# Altium schematic sheet power.SchDoc
size A4
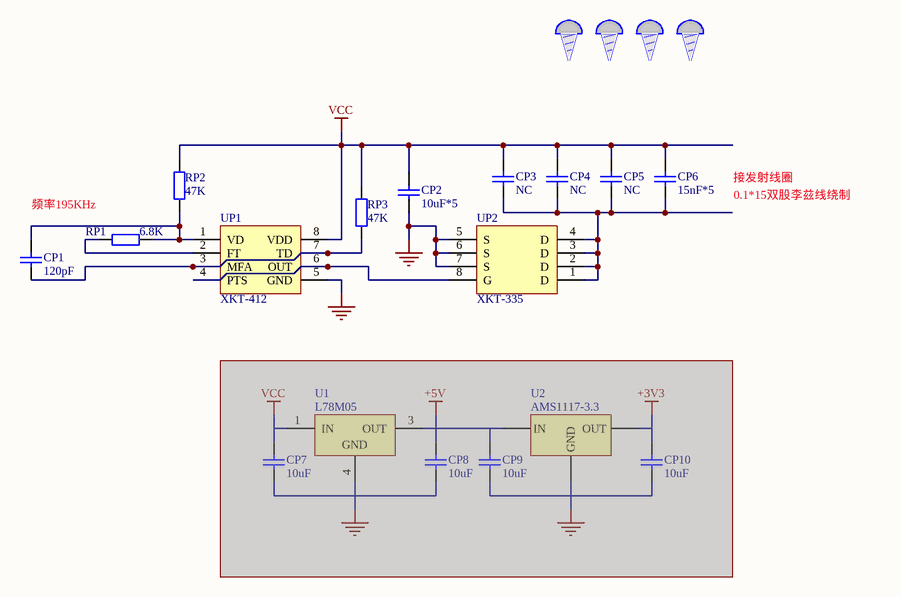
[diagram p0: power.SchDoc]

## Parts
CP1  value 120pF  [CAPC1608N]  (hidden comment: Cap1)
CP2  value 10uF*5  [CAPC1608N]  (hidden comment: Cap1)
CP3  value NC  [CAPC1608N]  (hidden comment: Cap1)
CP4  value NC  [CAPC1608N]  (hidden comment: Cap1)
CP5  value NC  [CAPC1608N]  (hidden comment: Cap1)
CP6  value 15nF*5  [CAPC1608N]  (hidden comment: Cap1)
CP7  value 10uF  [CAPC2012N]  (hidden comment: Cap1)  (masked out: inside a compile mask, not in the netlist)
CP8  value 10uF  [CAPC2012N]  (hidden comment: Cap1)  (masked out: inside a compile mask, not in the netlist)
CP9  value 10uF  [CAPC2012N]  (hidden comment: Cap1)  (masked out: inside a compile mask, not in the netlist)
CP10  value 10uF  [CAPC2012N]  (hidden comment: Cap1)  (masked out: inside a compile mask, not in the netlist)
M1  M  [TAPPING HOLE]  (value not drawn)
M2  M  [TAPPING HOLE]  (value not drawn)
M3  M  [TAPPING HOLE]  (value not drawn)
M4  M  [TAPPING HOLE]  (value not drawn)
RP1  value 6.8K  [RESC1608N]  (hidden comment: Res1)
RP2  value 47K  [RESC1608N]  (hidden comment: Res1)
RP3  value 47K  [RESC1608N]  (hidden comment: Res1)
U1  L78M05  [TO-252]  (masked out: inside a compile mask, not in the netlist)
U2  AMS1117-3.3  [SOT-223_N]  (masked out: inside a compile mask, not in the netlist)
UP1  XKT-412  [SOP8_L]
UP2  XKT-335  [SOP8_L]

## Nets
GND: CP2.1 UP1.5(GND) UP2.5(S) UP2.6(S) UP2.7(S)
VCC: CP2.2 CP3.2 CP4.2 CP5.2 CP6.2 RP2.2 RP3.2 UP1.8(VDD)
NetCP1_1: CP1.1 RP3.1 UP1.3(MFA) UP1.7(TD)
NetCP1_2: CP1.2 RP1.1 RP2.1 UP1.1(VD)
NetCP3_1: CP3.1 CP4.1 CP5.1 CP6.1 UP2.1(D) UP2.2(D) UP2.3(D) UP2.4(D)
NetRP1_2: RP1.2 UP1.2(FT)
NetUP1_4: UP1.4(PTS) UP1.6(OUT) UP2.8(G)

## Notes on the sheet
- 接发射线圈
- 频率195KHz
- 0.1*15双股李兹线绕制

## Library data of the parts
CP1-CP10 = Cap1: Capacitor; Published: 8-Jun-2000; LatestRevisionDate: 17-Jul-2002; LatestRevisionNote: Re-released for DXP Platform.; PackageReference: RAD-0.3; Publisher: Altium Limited
RP1-RP3 = Res1: Resistor; Published: 8-Jun-2000; LatestRevisionDate: 17-Jul-2002; LatestRevisionNote: Re-released for DXP Platform.; PackageReference: AXIAL-0.4; Publisher: Altium Limited
U1 = L78M05: Precision 500mA Regulator; Published: 24-Aug-2001; LatestRevisionDate: 06-Jun-2005; LatestRevisionNote: PCB pads lengthened.; DatasheetVersion: Mar-1997; PackageVersion: Jun-2004; PackageReference: TO-252; Publisher: Altium Limited; PackageDescription: D-PAK/TO-252-AA; 3 Leads (1 Cropped); Body 10.1 (inc. leads) x 6.6 mm (LxW max); ComponentLink1Description: Manufacturer Link; ComponentLink1URL: http://www.st.com/; ComponentLink2Description: Datasheet; ComponentLink2URL: http://www.st.com/stonline/products/literature/ds/2147/l78m05ab.pdf